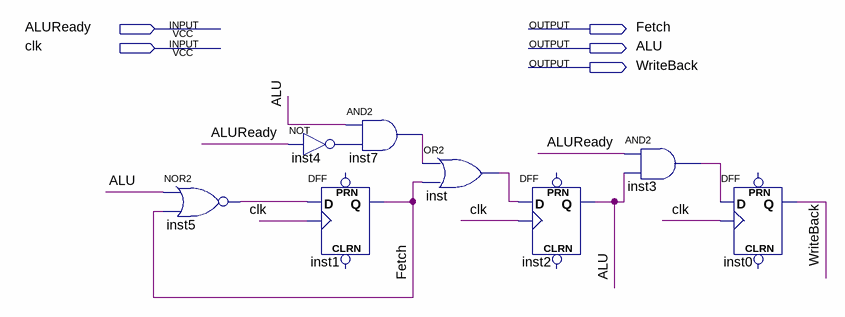
[diagram p0: schematic sheet]
// Quartus schematic MultiCycleCounter.bdf as structural Verilog: 8 symbols, 5 pins
module MultiCycleCounter (
  input  ALUReady,
  input  clk,
  output Fetch,
  output ALU,
  output WriteBack
);

  wire inst3_out, inst4_out, inst5_out, inst7_out, inst_out;

  nor inst5 (inst5_out, ALU, Fetch);
  and inst7 (inst7_out, ALU, inst4_out);
  not inst4 (inst4_out, ALUReady);
  DFF inst1 (.CLK(clk), .D(inst5_out), .Q(Fetch));  // open: CLRN, PRN
  or inst (inst_out, inst7_out, Fetch);
  DFF inst2 (.CLK(clk), .D(inst_out), .Q(ALU));  // open: CLRN, PRN
  and inst3 (inst3_out, ALUReady, ALU);
  DFF inst0 (.CLK(clk), .D(inst3_out), .Q(WriteBack));  // open: CLRN, PRN
endmodule
